# Altium schematic sheet HPCC_Connector_A.SchDoc
size B; SheetNumber: 4; SheetTotal: 11
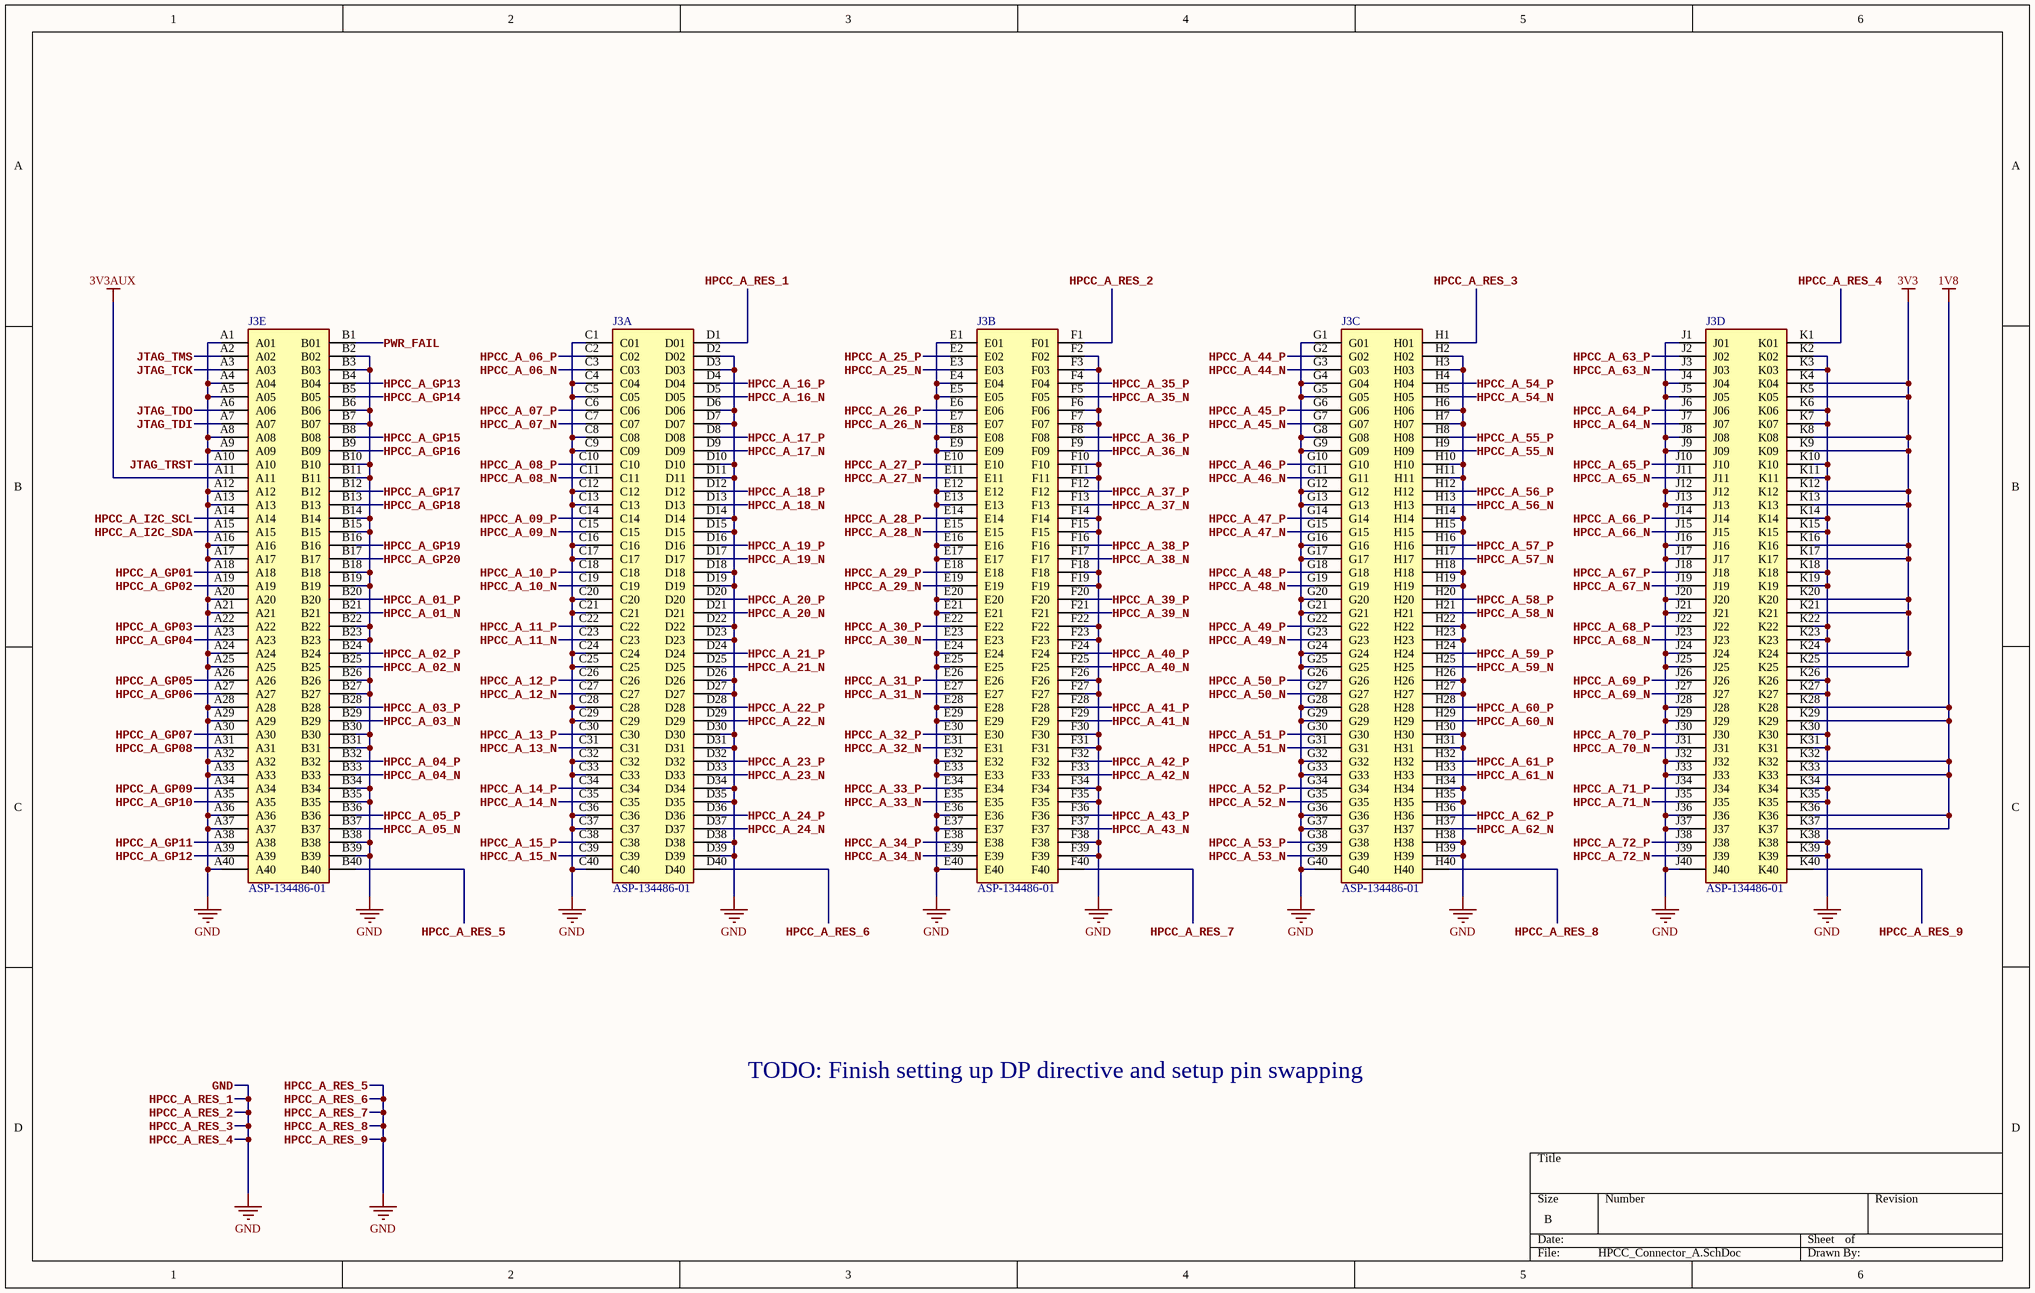
[diagram p0: HPCC_Connector_A.SchDoc]

## Parts
J3  ASP-134486-01  [SAMTEC_ASP-134486-01]  (parts A,B,C,D,E of 5)

## Nets
1V8: J3.K28 J3.K29 J3.K32 J3.K33 J3.K36 J3.K37
3V3: J3.K4(K04) J3.K5(K05) J3.K8(K08) J3.K9(K09) J3.K12 J3.K13 J3.K16 J3.K17 J3.K20 J3.K21 J3.K24 J3.K25
3V3AUX: J3.A11
GND: J3.A1(A01) J3.A4(A04) J3.A5(A05) J3.A8(A08) J3.A9(A09) J3.A12 J3.A13 J3.A16 J3.A17 J3.A20 J3.A21 J3.A24 J3.A25 J3.A28 J3.A29 J3.A32 J3.A33 J3.A36 J3.A37 J3.A40 J3.B2(B02) J3.B3(B03) J3.B6(B06) J3.B7(B07) J3.B10 J3.B11 J3.B14 J3.B15 J3.B18 J3.B19 J3.B22 J3.B23 J3.B26 J3.B27 J3.B30 J3.B31 J3.B34 J3.B35 J3.B38 J3.B39 J3.B40 J3.C1(C01) J3.C4(C04) J3.C5(C05) J3.C8(C08) J3.C9(C09) J3.C12 J3.C13 J3.C16 J3.C17 J3.C20 J3.C21 J3.C24 J3.C25 J3.C28 J3.C29 J3.C32 J3.C33 J3.C36 J3.C37 J3.C40 J3.D1(D01) J3.D2(D02) J3.D3(D03) J3.D6(D06) J3.D7(D07) J3.D10 J3.D11 J3.D14 J3.D15 J3.D18 J3.D19 J3.D22 J3.D23 J3.D26 J3.D27 J3.D30 J3.D31 J3.D34 J3.D35 J3.D38 J3.D39 J3.D40 J3.E1(E01) J3.E4(E04) J3.E5(E05) J3.E8(E08) J3.E9(E09) J3.E12 J3.E13 J3.E16 J3.E17 J3.E20 J3.E21 J3.E24 J3.E25 J3.E28 J3.E29 J3.E32 J3.E33 J3.E36 J3.E37 J3.E40 J3.F1(F01) J3.F2(F02) J3.F3(F03) J3.F6(F06) J3.F7(F07) J3.F10 J3.F11 J3.F14 J3.F15 J3.F18 J3.F19 J3.F22 J3.F23 J3.F26 J3.F27 J3.F30 J3.F31 J3.F34 J3.F35 J3.F38 J3.F39 J3.F40 J3.G1(G01) J3.G4(G04) J3.G5(G05) J3.G8(G08) J3.G9(G09) J3.G12 J3.G13 J3.G16 J3.G17 J3.G20 J3.G21 J3.G24 J3.G25 J3.G28 J3.G29 J3.G32 J3.G33 J3.G36 J3.G37 J3.G40 J3.H1(H01) J3.H2(H02) J3.H3(H03) J3.H6(H06) J3.H7(H07) J3.H10 J3.H11 J3.H14 J3.H15 J3.H18 J3.H19 J3.H22 J3.H23 J3.H26 J3.H27 J3.H30 J3.H31 J3.H34 J3.H35 J3.H38 J3.H39 J3.H40 J3.J1(J01) J3.J4(J04) J3.J5(J05) J3.J8(J08) J3.J9(J09) J3.J12 J3.J13 J3.J16 J3.J17 J3.J20 J3.J21 J3.J24 J3.J25 J3.J28 J3.J29 J3.J32 J3.J33 J3.J36 J3.J37 J3.J40 J3.K1(K01) J3.K2(K02) J3.K3(K03) J3.K6(K06) J3.K7(K07) J3.K10 J3.K11 J3.K14 J3.K15 J3.K18 J3.K19 J3.K22 J3.K23 J3.K26 J3.K27 J3.K30 J3.K31 J3.K34 J3.K35 J3.K38 J3.K39 J3.K40  [also labelled HPCC_A_RES_1, HPCC_A_RES_2, HPCC_A_RES_3, HPCC_A_RES_4, HPCC_A_RES_5, HPCC_A_RES_6, HPCC_A_RES_7, HPCC_A_RES_8, HPCC_A_RES_9]
HPCC_A_01_N: J3.B21
HPCC_A_01_P: J3.B20
HPCC_A_02_N: J3.B25
HPCC_A_02_P: J3.B24
HPCC_A_03_N: J3.B29
HPCC_A_03_P: J3.B28
HPCC_A_04_N: J3.B33
HPCC_A_04_P: J3.B32
HPCC_A_05_N: J3.B37
HPCC_A_05_P: J3.B36
HPCC_A_06_N: J3.C3(C03)
HPCC_A_06_P: J3.C2(C02)
HPCC_A_07_N: J3.C7(C07)
HPCC_A_07_P: J3.C6(C06)
HPCC_A_08_N: J3.C11
HPCC_A_08_P: J3.C10
HPCC_A_09_N: J3.C15
HPCC_A_09_P: J3.C14
HPCC_A_10_N: J3.C19
HPCC_A_10_P: J3.C18
HPCC_A_11_N: J3.C23
HPCC_A_11_P: J3.C22
HPCC_A_12_N: J3.C27
HPCC_A_12_P: J3.C26
HPCC_A_13_N: J3.C31
HPCC_A_13_P: J3.C30
HPCC_A_14_N: J3.C35
HPCC_A_14_P: J3.C34
HPCC_A_15_N: J3.C39
HPCC_A_15_P: J3.C38
HPCC_A_16_N: J3.D5(D05)
HPCC_A_16_P: J3.D4(D04)
HPCC_A_17_N: J3.D9(D09)
HPCC_A_17_P: J3.D8(D08)
HPCC_A_18_N: J3.D13
HPCC_A_18_P: J3.D12
HPCC_A_19_N: J3.D17
HPCC_A_19_P: J3.D16
HPCC_A_20_N: J3.D21
HPCC_A_20_P: J3.D20
HPCC_A_21_N: J3.D25
HPCC_A_21_P: J3.D24
HPCC_A_22_N: J3.D29
HPCC_A_22_P: J3.D28
HPCC_A_23_N: J3.D33
HPCC_A_23_P: J3.D32
HPCC_A_24_N: J3.D37
HPCC_A_24_P: J3.D36
HPCC_A_25_N: J3.E3(E03)
HPCC_A_25_P: J3.E2(E02)
HPCC_A_26_N: J3.E7(E07)
HPCC_A_26_P: J3.E6(E06)
HPCC_A_27_N: J3.E11
HPCC_A_27_P: J3.E10
HPCC_A_28_N: J3.E15
HPCC_A_28_P: J3.E14
HPCC_A_29_N: J3.E19
HPCC_A_29_P: J3.E18
HPCC_A_30_N: J3.E23
HPCC_A_30_P: J3.E22
HPCC_A_31_N: J3.E27
HPCC_A_31_P: J3.E26
HPCC_A_32_N: J3.E31
HPCC_A_32_P: J3.E30
HPCC_A_33_N: J3.E35
HPCC_A_33_P: J3.E34
HPCC_A_34_N: J3.E39
HPCC_A_34_P: J3.E38
HPCC_A_35_N: J3.F5(F05)
HPCC_A_35_P: J3.F4(F04)
HPCC_A_36_N: J3.F9(F09)
HPCC_A_36_P: J3.F8(F08)
HPCC_A_37_N: J3.F13
HPCC_A_37_P: J3.F12
HPCC_A_38_N: J3.F17
HPCC_A_38_P: J3.F16
HPCC_A_39_N: J3.F21
HPCC_A_39_P: J3.F20
HPCC_A_40_N: J3.F25
HPCC_A_40_P: J3.F24
HPCC_A_41_N: J3.F29
HPCC_A_41_P: J3.F28
HPCC_A_42_N: J3.F33
HPCC_A_42_P: J3.F32
HPCC_A_43_N: J3.F37
HPCC_A_43_P: J3.F36
HPCC_A_44_N: J3.G3(G03)
HPCC_A_44_P: J3.G2(G02)
HPCC_A_45_N: J3.G7(G07)
HPCC_A_45_P: J3.G6(G06)
HPCC_A_46_N: J3.G11
HPCC_A_46_P: J3.G10
HPCC_A_47_N: J3.G15
HPCC_A_47_P: J3.G14
HPCC_A_48_N: J3.G19
HPCC_A_48_P: J3.G18
HPCC_A_49_N: J3.G23
HPCC_A_49_P: J3.G22
HPCC_A_50_N: J3.G27
HPCC_A_50_P: J3.G26
HPCC_A_51_N: J3.G31
HPCC_A_51_P: J3.G30
HPCC_A_52_N: J3.G35
HPCC_A_52_P: J3.G34
HPCC_A_53_N: J3.G39
HPCC_A_53_P: J3.G38
HPCC_A_54_N: J3.H5(H05)
HPCC_A_54_P: J3.H4(H04)
HPCC_A_55_N: J3.H9(H09)
HPCC_A_55_P: J3.H8(H08)
HPCC_A_56_N: J3.H13
HPCC_A_56_P: J3.H12
HPCC_A_57_N: J3.H17
HPCC_A_57_P: J3.H16
HPCC_A_58_N: J3.H21
HPCC_A_58_P: J3.H20
HPCC_A_59_N: J3.H25
HPCC_A_59_P: J3.H24
HPCC_A_60_N: J3.H29
HPCC_A_60_P: J3.H28
HPCC_A_61_N: J3.H33
HPCC_A_61_P: J3.H32
HPCC_A_62_N: J3.H37
HPCC_A_62_P: J3.H36
HPCC_A_63_N: J3.J3(J03)
HPCC_A_63_P: J3.J2(J02)
HPCC_A_64_N: J3.J7(J07)
HPCC_A_64_P: J3.J6(J06)
HPCC_A_65_N: J3.J11
HPCC_A_65_P: J3.J10
HPCC_A_66_N: J3.J15
HPCC_A_66_P: J3.J14
HPCC_A_67_N: J3.J19
HPCC_A_67_P: J3.J18
HPCC_A_68_N: J3.J23
HPCC_A_68_P: J3.J22
HPCC_A_69_N: J3.J27
HPCC_A_69_P: J3.J26
HPCC_A_70_N: J3.J31
HPCC_A_70_P: J3.J30
HPCC_A_71_N: J3.J35
HPCC_A_71_P: J3.J34
HPCC_A_72_N: J3.J39
HPCC_A_72_P: J3.J38
HPCC_A_GP01: J3.A18
HPCC_A_GP02: J3.A19
HPCC_A_GP03: J3.A22
HPCC_A_GP04: J3.A23
HPCC_A_GP05: J3.A26
HPCC_A_GP06: J3.A27
HPCC_A_GP07: J3.A30
HPCC_A_GP08: J3.A31
HPCC_A_GP09: J3.A34
HPCC_A_GP10: J3.A35
HPCC_A_GP11: J3.A38
HPCC_A_GP12: J3.A39
HPCC_A_GP13: J3.B4(B04)
HPCC_A_GP14: J3.B5(B05)
HPCC_A_GP15: J3.B8(B08)
HPCC_A_GP16: J3.B9(B09)
HPCC_A_GP17: J3.B12
HPCC_A_GP18: J3.B13
HPCC_A_GP19: J3.B16
HPCC_A_GP20: J3.B17
HPCC_A_I2C_SCL: J3.A14
HPCC_A_I2C_SDA: J3.A15
JTAG_TCK: J3.A3(A03)
JTAG_TDI: J3.A7(A07)
JTAG_TDO: J3.A6(A06)
JTAG_TMS: J3.A2(A02)
JTAG_TRST: J3.A10
PWR_FAIL: J3.B1(B01)

## Notes on the sheet
- TODO: Finish setting up DP directive and setup pin swapping

## Library data of the parts
J3 = ASP-134486-01: 400 Position Connector Array, Female Sockets Surface Mount Gold; Manufacturer: Samtec; Manufacturer Part Number: ASP-134486-01